# Altium schematic sheet SCH_RS485.SchDoc
size A; SheetNumber: 1; SheetTotal: 1
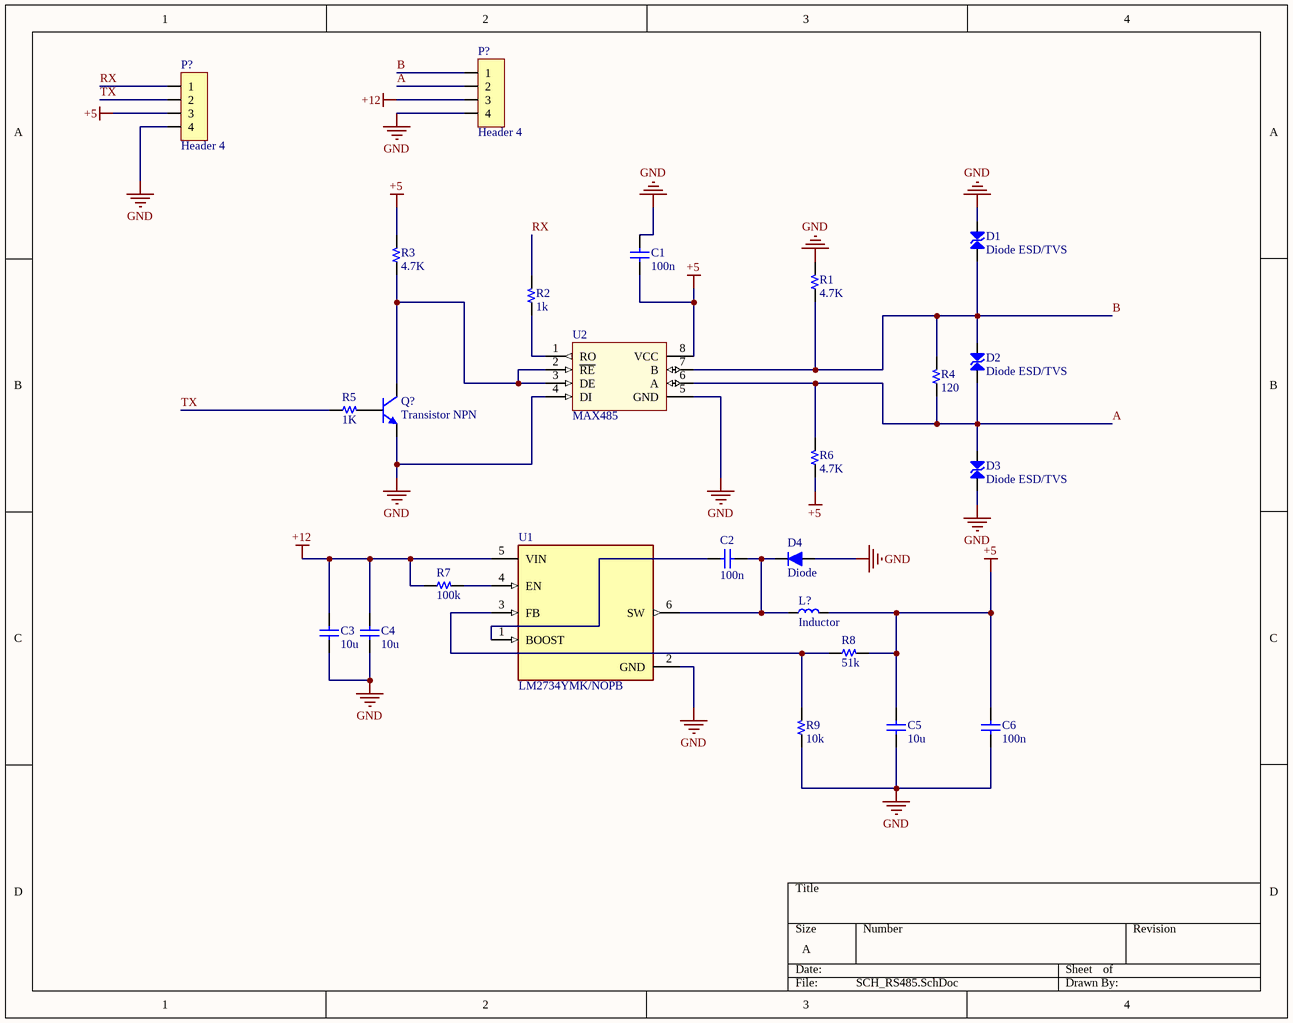
[diagram p0: SCH_RS485.SchDoc]

## Parts
(Parts that share a designator on the sheet are numbered #1, #2 ... from top to bottom, then left to right.)
C1  100n  [C 0805]
C2  100n  [C 0805]
C3  10u  [C 0805]
C4  10u  [C 0805]
C5  10u  [C 0805]
C6  100n  [C 0805]
D1  Diode ESD/TVS  [SOD123]
D2  Diode ESD/TVS  [SOD123]
D3  Diode ESD/TVS  [SOD123]
D4  Diode  [SOD123]
L?  Inductor  [Inductor SMD CDRH3D48]
P?#1  Header 4  [HDR/Terminal/4/RA]
P?#2  Header 4  [HDR/Header/4/2mm/BOX/RA]
Q?  Transistor NPN  [SOT-23]
R1  4.7K  [R 0805]
R2  1k  [R 0805]
R3  4.7K  [R 0805]
R4  120  [R 0805]
R5  1K  [R 0805]
R6  4.7K  [R 0805]
R7  100k  [R 0805]
R8  51k  [R 0805]
R9  10k  [R 0805]
U1  LM2734YMK/NOPB  [SOT95P280X110-6N]
U2  MAX485  [SOIC-8]

## Nets
+5: C1.2 C5.1 C6.1 L?.2 P?#2.3 R3.2 R6.1 R8.2 U2.8(VCC)
+12: C3.1 C4.1 P?#1.3 R7.1 U1.5(VIN)
GND: C1.1 C3.2 C4.2 C5.2 C6.2 D1.2(K) D3.1(A) D4.1(A) P?#1.4 P?#2.4 Q?.2(E) R1.2 R9.1 U1.2(GND) U2.4(DI) U2.5(GND)
A: D2.1(A) D3.2(K) P?#1.2 R4.1 R6.2 U2.6(A)
B: D1.1(A) D2.2(K) P?#1.1 R1.1 R4.2 U2.7(B)
RX: P?#2.1 R2.2
TX: P?#2.2 R5.1
NetC2_1: C2.1 U1.1(BOOST)
NetC2_2: C2.2 D4.2(K) L?.1 U1.6(SW)
NetQ?_1: Q?.1(B) R5.2
NetQ?_3: Q?.3(C) R3.1 U2.2(~{RE}) U2.3(DE)
NetR2_1: R2.1 U2.1(RO)
NetR7_2: R7.2 U1.4(EN)
NetR8_1: R8.1 R9.2 U1.3(FB)

## Library data of the parts
C1-C6 = Capacitor NP: Capacitor non-pol
D4 = Diode: Default Diode
P?#1 P?#2 = Header 4: Header, 4-Pin
Q? = Transistor NPN: NPN Bipolar Transistor
R1-R9 = Resistor
U1 = LM2734YMK/NOPB: 3V to 20V Input, 1A Step-Down Converter with Light Load Efficiency 6-SOT-23-THIN -40 to 125; MF: Texas Instruments; SnapEDA_Link: https://www.snapeda.com/parts/LM2734YMK/Texas+Instruments/view-part/?ref=snap; Package: SOT-23-THN-6 Texas Instruments; MP: LM2734YMK; Check_prices: https://www.snapeda.com/parts/LM2734YMK/Texas+Instruments/view-part/?ref=eda; Purchase-URL: https://pricing.snapeda.com/search/part/LM2734YMK/?ref=eda; Price: None; Value: *; Availability: In Stock
U2 = MAX485: Low-Power, Slew-Rate-Limited  RS-485/RS-422 Transceivers